# Altium schematic sheet BoostRegulator.SchDoc
size A4; SheetNumber: 3; SheetTotal: 4
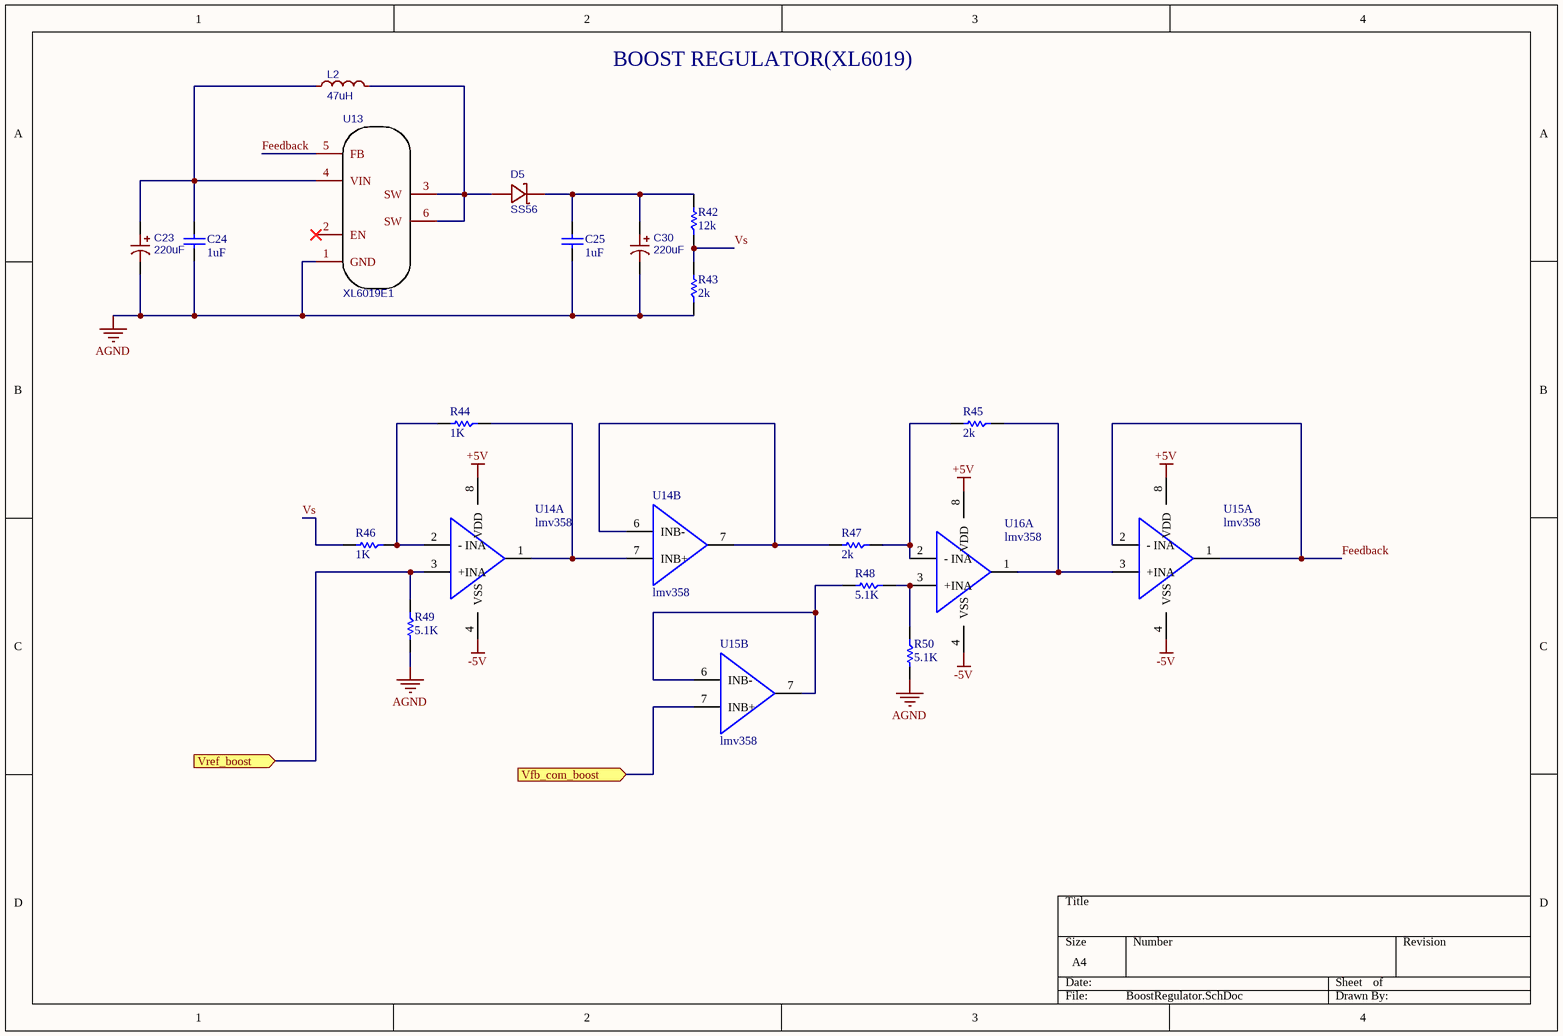
[diagram p0: BoostRegulator.SchDoc]

## Parts
C23  220uF  [CAP-SMD_BD10.0-L10.3-W10.3-LS11.0-FD]
C24  1uF  [0805C]
C25  1uF  [0805C]
C30  220uF  [CAP-SMD_BD10.0-L10.3-W10.3-LS11.0-FD]
D5  SS56  [SMA_L4.3-W2.6-LS5.2-RD]
L2  47uH  [IND-SMD_L12.6-W12.6_MCF-13XX]
R42  12k  [0805]
R43  2k  [0805]
R44  1K  [0805]
R45  2k  [0805]
R46  1K  [0805]
R47  2k  [0805]
R48  5.1K  [0805]
R49  5.1K  [0805]
R50  5.1K  [0805]
U13  XL6019E1  [TO-263-5_L10.2-W9.9-P1.70-LS14.4-TL]
U14  lmv358  [SOP-8_L4.9-W3.9-P1.27-LS6.0-BL]  (parts A,B of 2)
U15  lmv358  [SOP-8_L4.9-W3.9-P1.27-LS6.0-BL]  (parts A,B of 2)
U16  lmv358  [SOP-8_L4.9-W3.9-P1.27-LS6.0-BL]  (part A of 2)

## Ports
Vfb_com_boost (in), Vref_boost (in)

## Nets
+5V: U14.8(VDD) U15.8(VDD) U16.8(VDD)
-5V: U14.4(VSS) U15.4(VSS) U16.4(VSS)
AGND: C23.2 C24.2 C25.2 C30.2 R43.1 R49.2 R50.2 U13.1(GND)
Feedback: U13.5(FB) U15.1(OUTA) U15.2(-_INA)
Vfb_com_boost: U15.7(INB+) ; port Vfb_com_boost
Vref_boost: R49.1 U14.3(+INA) ; port Vref_boost
Vs: R42.1 R43.2 R46.2
NetC23_1: C23.1 C24.1 L2.1 U13.4(VIN)
NetC25_1: C25.1 C30.1 D5.1(K) R42.2
NetD5_2: D5.2(A) L2.2 U13.3(SW) U13.6(SW)
NetR44_1: R44.1 U14.1(OUTA) U14.7(INB+)
NetR44_2: R44.2 R46.1 U14.2(-_INA)
NetR45_1: R45.1 U15.3(+INA) U16.1(OUTA)
NetR45_2: R45.2 R47.1 U16.2(-_INA)
NetR47_2: R47.2 U14.6(INB-) U14.7(OUTB)
NetR48_1: R48.1 R50.1 U16.3(+INA)
NetR48_2: R48.2 U15.6(INB-) U15.7(OUTB)

Not connected (* = marked no-connect by the designer): U13 2(EN)*

## Notes on the sheet
- BOOST REGULATOR(XL6019)

## Library data of the parts
C23 C30 = 220uF: BOM_Manufacturer: KNSCHA(科尼盛); BOM_Manufacturer Part: RVT220UF50V67RV0021; nameAlias: Capacitance; Contributor: LCSC; BOM_Supplier: LCSC; BOM_Supplier Part: C2887271; BOM_JLCPCB Part Class: Extended Part; spicePre: C; spiceSymbolName: RVT220UF50V67RV0021
C24 C25 = C_1uf: Capacitor; Reviewed by: RM - 2018/08/05; Revision: July-2002: Re-released for DXP Platform.; Supplier 1: *; Supplier Part Number 1: *; Value: 1uF
D5 = SS56: BOM_Manufacturer: MDD; BOM_Supplier: LCSC; BOM_Manufacturer Part: SS56; BOM_Supplier Part: C65009; BOM_JLCPCB Part Class: Extended Part; spicePre: D; spiceSymbolName: SS56
L2 = 47uH: BOM_Manufacturer: YJYCOIN; BOM_Manufacturer Part: YSPI1365-470M; nameAlias: Inductance; Contributor: LCSC; BOM_Supplier: LCSC; BOM_Supplier Part: C497913; BOM_JLCPCB Part Class: Extended Part; spicePre: L; spiceSymbolName: YSPI1365-470M
R42 = R_12k: Resistor; Reviewed by: RM - 2018/08/05; Supplier 1: *; Suppler Part Number 1: *; Value: 12k
R43 = R_2k: Resistor; Reviewed by: RM - 2018/08/05; Supplier 1: *; Suppler Part Number 1: *; Value: 2k
R44 R46 = R_6: Resistor; Reviewed by: RM - 2018/08/05; Supplier 1: *; Suppler Part Number 1: *; Value: 1K
R45 R47 = R_3: Resistor; Reviewed by: RM - 2018/08/05; Supplier 1: *; Suppler Part Number 1: *; Value: 2k
R48-R50 = R_1: Resistor; Reviewed by: RM - 2018/08/05; Supplier 1: *; Suppler Part Number 1: *; Value: 5.1K
U13 = XL6019E1: BOM_Manufacturer: XLSEMI; BOM_Supplier: LCSC; BOM_Manufacturer Part: XL6019E1; BOM_Supplier Part: C73018; BOM_JLCPCB Part Class: Extended Part; spicePre: U; spiceSymbolName: XL6019E1
U14-U16 = LMV358-SR: OpAmp High Frequency Dual; Reviewed by: RM - 2018/08/05